# EAGLE design v1 (EAGLE 9.6.2)
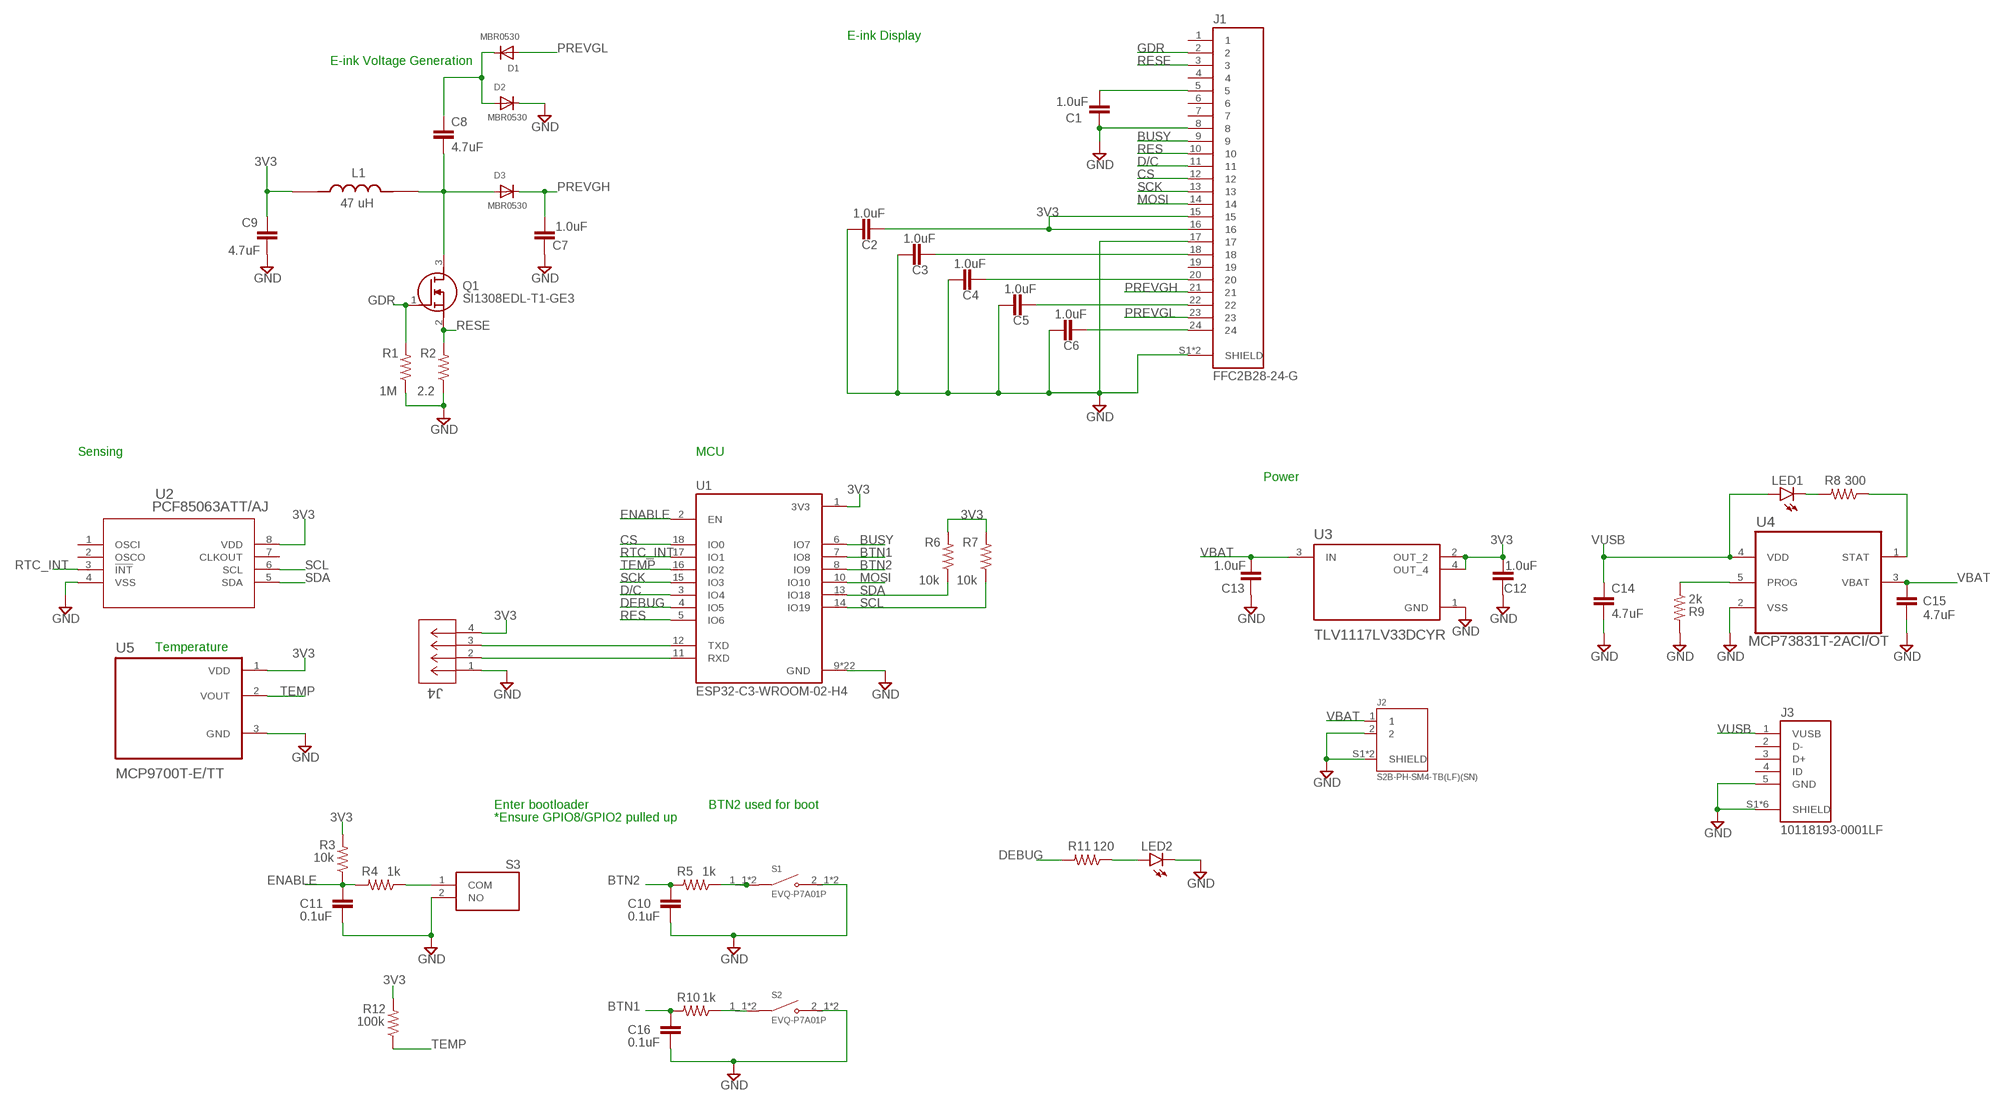
[diagram p0: schematic, sheet 1]

## Parts
C1  1.0uF  1.0UF-0603-16V-10%-X7R-WE  [0603]
C2  1.0uF  1.0UF-0603-16V-10%-X7R-WE  [0603]
C3  1.0uF  1.0UF-0603-16V-10%-X7R-WE  [0603]
C4  1.0uF  1.0UF-0603-16V-10%-X7R-WE  [0603]
C5  1.0uF  1.0UF-0603-16V-10%-X7R-WE  [0603]
C6  1.0uF  1.0UF-0603-16V-10%-X7R-WE  [0603]
C7  1.0uF  1.0UF-0603-16V-10%-X7R-WE  [0603]
C8  4.7uF  4.7UF-0603-35V-(20%)  [0603]
C9  4.7uF  4.7UF-0603-35V-(20%)  [0603]
C10  0.1uF  0.1UF-0603-25V-(+80/-20%)  [0603]
C11  0.1uF  0.1UF-0603-25V-(+80/-20%)  [0603]
C12  1.0uF  1.0UF-0603-16V-10%-X7R-WE  [0603]
C13  1.0uF  1.0UF-0603-16V-10%-X7R-WE  [0603]
C14  4.7uF  4.7UF-0603-35V-(20%)  [0603]
C15  4.7uF  4.7UF-0603-35V-(20%)  [0603]
C16  0.1uF  0.1UF-0603-25V-(+80/-20%)  [0603]
D1  MBR0530  [SOD323F]
D2  MBR0530  [SOD323F]
D3  MBR0530  [SOD323F]
J1  FFC2B28-24-G  [GCT_FFC2B28-24-G]
J2  S2B-PH-SM4-TB(LF)(SN)  [JST_S2B-PH-SM4-TB(LF)(SN)]
J3  10118193-0001LF  [AMPHENOL_10118193-0001LF]
J4  851-43-004-20-001000  [CONN_851-43-004-20-001000_MIM]
L1  47 uH  ADL3225V-470MT-TL000  [IND_ADL3225V-470MT-TL000]
LED1  LEDCHIP-LED0603  [CHIP-LED0603]
LED2  LEDCHIP-LED0603  [CHIP-LED0603]
Q1  SI1308EDL-T1-GE3  [SOT65P210X110-3N]
R1  1M  R-US_R0603  [R0603]
R2  2.2  R-US_R0603  [R0603]
R3  10k  R-US_R0603  [R0603]
R4  1k  R-US_R0603  [R0603]
R5  1k  R-US_R0603  [R0603]
R6  10k  R-US_R0603  [R0603]
R7  10k  R-US_R0603  [R0603]
R8  300  R-US_R0603  [R0603]
R9  2k  R-US_R0603  [R0603]
R10  1k  R-US_R0603  [R0603]
R11  120  R-US_R0603  [R0603]
R12  100k  R-US_R0603  [R0603]
S1  EVQ-P7A01P  [SW_EVQ-P7A01P]
S2  EVQ-P7A01P  [SW_EVQ-P7A01P]
S3  PTS636_SM25F_SMTR_LFS  [PTS636SM25FSMTRLFS]
U1  ESP32-C3-WROOM-02-H4  [MODULE_ESP32-C3-WROOM-02-H4]
U2  PCF85063ATT/AJ  [PCF85063ATT/AJ_NXP]
U3  TLV1117LV33DCYR  [VREG_TLV1117LV33DCYR]
U4  MCP73831T-2ACI/OT  [SOT95P280X145-5N]
U5  MCP9700T-E/TT  [SOT95P237X112-3N]

## Nets
3V3: C2.1 C9.1 C12.1 J1.15 J1.16 J4.4 L1.1 R3.2 R6.2 R7.2 R12.2 U1.1(3V3) U2.8(VDD) U3.2(OUT_2) U3.4(OUT_4) U5.1(VDD)
BTN1: C16.1 R10.2 U1.7(IO8)
BTN2: C10.1 R5.2 U1.8(IO9)
BUSY: J1.9 U1.6(IO7)
CS: J1.12 U1.18(IO0)
D/C: J1.11 U1.3(IO4)
DEBUG: R11.2 U1.4(IO5)
ENABLE: C11.1 R3.1 R4.2 U1.2(EN)
GDR: J1.2 Q1.1(G) R1.2
GND: C1.2 C2.2 C3.2 C4.2 C5.2 C6.2 C7.2 C9.2 C10.2 C11.2 C12.2 C13.2 C14.2 C15.2 C16.2 D2.C J1.8 J1.17 J1.S1(SHIELD) J1.S2(SHIELD) J2.2 J2.S1(SHIELD) J2.S2(SHIELD) J3.5(GND) J3.S1(SHIELD) J3.S2(SHIELD) J3.S3(SHIELD) J3.S4(SHIELD) J3.S5(SHIELD) J3.S6(SHIELD) J4.1 LED2.C R1.1 R2.1 R9.2 S1.2_1 S1.2_2 S2.2_1 S2.2_2 S3.2(NO) U1.9(GND) U1.19(GND) U1.20(GND) U1.21(GND) U1.22(GND) U1.23(GND) U1.24(GND) U1.25(GND) U1.26(GND) U1.27(GND) U1.28(GND) U1.29(GND) U1.30(GND) U1.31(GND) U1.32(GND) U1.33(GND) U1.34(GND) U1.35(GND) U1.36(GND) U1.37(GND) U1.38(GND) U1.39(GND) U2.4(VSS) U3.1(GND) U4.2(VSS) U5.3(GND)
MOSI: J1.14 U1.10(IO10)
N$1: C1.1 J1.5
N$2: C3.1 J1.18
N$3: C4.1 J1.20
N$4: C5.1 J1.22
N$5: C8.2 D3.A L1.2 Q1.3(D)
N$6: C6.1 J1.24
N$7: C8.1 D1.C D2.A
N$8: R4.1 S3.1(COM)
N$9: R5.1 S1.1_1 S1.1_2
N$10: R10.1 S2.1_1 S2.1_2
N$11: J4.3 U1.12(TXD)
N$12: J4.2 U1.11(RXD)
N$13: LED1.C R8.2
N$14: R8.1 U4.1(STAT)
N$15: R9.1 U4.5(PROG)
N$17: LED2.A R11.1
PREVGH: C7.1 D3.C J1.21
PREVGL: D1.A J1.23
RES: J1.10 U1.5(IO6)
RESE: J1.3 Q1.2(S) R2.2
RTC_INT: U1.17(IO1) U2.3(!INT)
SCK: J1.13 U1.15(IO3)
SCL: R7.1 U1.14(IO19) U2.6(SCL)
SDA: R6.1 U1.13(IO18) U2.5(SDA)
TEMP: R12.1 U1.16(IO2) U5.2(VOUT)
VBAT: C13.1 C15.1 J2.1 U3.3(IN) U4.3(VBAT)
VUSB: C14.1 J3.1(VUSB) LED1.A U4.4(VDD)
Unconnected: J1.1 J1.4 J1.6 J1.7 J1.19 J3.2(D-) J3.3(D+) J3.4(ID) U2.1(OSCI) U2.2(OSCO) U2.7(CLKOUT)

## Notes on the sheet
- E-ink Display
- E-ink Voltage Generation
- Sensing | MCU
- Power
- Temperature
- Enter bootloader | BTN2 used for boot
- *Ensure GPIO8/GPIO2 pulled up

## Library data of the parts
C1-C7 C12 C13 = SparkFun-Capacitors:1.0UF: 1µF ceramic capacitors A capacitor is a passive two-terminal electrical component used to store electrical energy temporarily in an electric field.; PROD_ID: CAP-16504
C8 C9 C14 C15 = SparkFun-Capacitors:4.7UF: 4.7µF ceramic capacitors A capacitor is a passive two-terminal electrical component used to store electrical energy temporarily in an electric field.; PROD_ID: CAP-14106
C10 C11 C16 = SparkFun-Capacitors:0.1UF: 0.1µF ceramic capacitors A capacitor is a passive two-terminal electrical component used to store electrical energy temporarily in an electric field.; PROD_ID: CAP-00810
D1-D3 = MBR0530:MBR0530: Check availability <https://pricing.snapeda.com/parts/MBR0530/ON%20Semiconductor/view-part?ref=eda>; AVAILABILITY: In Stock; CHECK_PRICES: https://www.snapeda.com/parts/MBR0530/Onsemi/view-part/?ref=eda; DESCRIPTION: Diode Schottky 30 V 500mA Surface Mount SOD-123; MF: ON Semiconductor; MP: MBR0530; PACKAGE: SOD-123-2 ON Semiconductor; PRICE: None; PURCHASE-URL: https://www.snapeda.com/api/url_track_click_mouser/?unipart_id=179458&manufacturer=ON Semiconductor&part_name=MBR0530&search_term=None; SNAPEDA_LINK: https://www.snapeda.com/parts/MBR0530/Onsemi/view-part/?ref=snap
J1 = FFC2B28-24-G:FFC2B28-24-G: FPC 0.5mm Pitch, Side entry, Dual contact, SMT, Height 1mm, Back Flip Check availability <https://pricing.snapeda.com/parts/FFC2B28-24-G/Global%20Connector%20Technology/view-part?ref=eda>; AVAILABILITY: Not in stock; CHECK_PRICES: https://www.snapeda.com/parts/FFC2B28-24-G/Global+Connector+Technology/view-part/?ref=eda; DESCRIPTION: 24 Position FFC, FPC Connector Contacts, Top and Bottom 0.020 (0.50mm) Surface Mount, Right Angle; MF: Global Connector Technology; MP: FFC2B28-24-G; PACKAGE: None; PRICE: None; SNAPEDA_LINK: https://www.snapeda.com/parts/FFC2B28-24-G/Global+Connector+Technology/view-part/?ref=snap
J2 = S2B-PH-SM4-TB_LF__SN_:S2B-PH-SM4-TB(LF)(SN): PH Series 2 Position 2 mm Pitch Surface Mount Side Entry Shrouded Header Check availability <https://pricing.snapeda.com/parts/S2B-PH-SM4-TB%28LF%29%28SN%29/JST%20Sales/view-part?ref=eda>; AVAILABILITY: In Stock; CHECK_PRICES: https://www.snapeda.com/parts/S2B-PH-SM4-TB(LF)(SN)/JST+Sales+America+Inc./view-part/?ref=eda; DESCRIPTION: Connector Header Surface Mount, Right Angle 2 position 0.079 (2.00mm); MF: JST Sales; MP: S2B-PH-SM4-TB(LF)(SN); PACKAGE: None; PRICE: None; SNAPEDA_LINK: https://www.snapeda.com/parts/S2B-PH-SM4-TB(LF)(SN)/JST+Sales+America+Inc./view-part/?ref=snap
J3 = 10118193-0001LF:10118193-0001LF: Check availability <https://pricing.snapeda.com/parts/10118193-0001LF/Amphenol%20ICC/view-part?ref=eda>; AVAILABILITY: In Stock; CHECK_PRICES: https://www.snapeda.com/parts/10118193-0001LF/Amphenol+FCI/view-part/?ref=eda; DESCRIPTION: Right Angle Surface Mount Mount Female USB Connector 100 V ac 1.8A | Amphenol FCI (Amphenol CS) 10118193-0001LF; MF: Amphenol ICC; MP: 10118193-0001LF; PACKAGE: None; PRICE: None; PURCHASE-URL: https://www.snapeda.com/api/url_track_click_mouser/?unipart_id=110244&manufacturer=Amphenol ICC&part_name=10118193-0001LF&search_term=None; SNAPEDA_LINK: https://www.snapeda.com/parts/10118193-0001LF/Amphenol+FCI/view-part/?ref=snap
J4 = 851-43-004-20-001000:851-43-004-20-001000; COPYRIGHT: Copyright (C) 2024 Ultra Librarian. All rights reserved.; MANUFACTURER_PART_NUMBER: 851-43-004-20-001000; MFR_NAME: Mill-Max
L1 = ADL3225V-470MT-TL000:ADL3225V-470MT-TL000: Check availability <https://pricing.snapeda.com/parts/ADL3225V-470MT-TL000/TDK/view-part?ref=eda>; AVAILABILITY: In Stock; CHECK_PRICES: https://www.snapeda.com/parts/ADL3225V-470MT-TL000/TDK/view-part/?ref=eda; DESCRIPTION: 47 µH Unshielded Wirewound Inductor 500 mA 900mOhm Max 1210 (3225 Metric); MF: TDK; MP: ADL3225V-470MT-TL000; PACKAGE: None; PRICE: None; PURCHASE-URL: https://www.snapeda.com/api/url_track_click_mouser/?unipart_id=1658563&manufacturer=TDK&part_name=ADL3225V-470MT-TL000&search_term=None; SNAPEDA_LINK: https://www.snapeda.com/parts/ADL3225V-470MT-TL000/TDK/view-part/?ref=snap
LED1 LED2 = led:LED: LED OSRAM: - CHIPLED LG R971, LG N971, LY N971, LG Q971, LY Q971, LO R971, LY R971 LH N974, LH R974 LS Q976, LO Q976, LY Q976 LO Q996 - Hyper CHIPLED LW Q18S LB Q993, LB Q99A, LB R99A - SideLED LS A670, LO A670, LY A670, LG A670, LP A670 LB A673, LV A673, LT A673, LW A673 LH A674 LY A675 LS A676, LA A676, LO A676, LY A676, LW A676 LS A679, LY A679, LG A679 - Hyper Micro SIDELED® LS Y876, LA Y876, LO Y876, LY Y876 LT Y87S - SmartLED LW L88C, LW L88S LB L89C, LB L89S, LG L890 LS L89K, LO L89K, LY L89K LS L896, LA L896, LO L896, LY L896 - TOPLED LS T670, LO T670, LY T670, LG T670, LP T670 LSG T670, LSP T670, LSY T670, LOP T670, LYG T670 LG T671, LOG T671, LSG T671 LB T673, LV T673, LT T673, LW T673 LH T674 LS T676, LA T676, LO T676, LY T676, LB T676, LH T676, LSB T676, LW T676 LB T67C, LV T67C, LT T67C, LS T67K, LO T67K, LY T67K, LW E67C LS E67B, LA E67B, LO E67B, LY E67B, LB E67C, LV E67C, LT E67C LW T67C LS T679, LY T679, LG T679 LS T770, LO T770, LY T770, LG T770, LP T770 LB T773, LV T773, LT T773, LW T773 LH T774 LS E675, LA E675, LY E675, LS T675 LS T776, LA T776, LO T776, LY T776, LB T776 LHGB T686 LT T68C, LB T68C - Hyper Mini TOPLED® LB M676 - Mini TOPLED Santana® LG M470 LS M47K, LO M47K, LY M47K Source: http://www.osram.convergy.de LUXEON: - LUMILED® LXK2-PW12-R00, LXK2-PW12-S00, LXK2-PW14-U00, LXK2-PW14-V00 LXK2-PM12-R00, LXK2-PM12-S00, LXK2-PM14-U00 LXK2-PE12-Q00, LXK2-PE12-R00, LXK2-PE12-S00, LXK2-PE14-T00, LXK2-PE14-U00 LXK2-PB12-K00, LXK2-PB12-L00, LXK2-PB12-M00, LXK2-PB14-N00, LXK2-PB14-P00, LXK2-PB14-Q00 LXK2-PR12-L00, LXK2-PR12-M00, LXK2-PR14-Q00, LXK2-PR14-R00 LXK2-PD12-Q00, LXK2-PD12-R00, LXK2-PD12-S00 LXK2-PH12-R00, LXK2-PH12-S00 LXK2-PL12-P00, LXK2-PL12-Q00, LXK2-PL12-R00 Source: www.luxeon.com KINGBRIGHT: KA-3528ASYC Source: www.kingbright.com
Q1 = SI1308EDL-T1-GE3:SI1308EDL-T1-GE3: MOSFET N-Ch 30V 1.5A TrenchFET SC70 Vishay Si1308EDL-T1-GE3 N-channel MOSFET Transistor, 1.5 A, 30 V, 3-Pin SC-70 Source: Datasheet <https://componentsearchengine.com/Datasheets/1/SI1308EDL-T1-GE3.pdf> Check availability <https://pricing.snapeda.com/parts/SI1308EDL-T1-GE3/Vishay%20Siliconix/view-part?ref=eda>; AVAILABILITY: In Stock; CHECK_PRICES: https://www.snapeda.com/parts/SI1308EDL-T1-GE3/Vishay+Siliconix/view-part/?ref=eda; DESCRIPTION: Si1308EDL-T1-GE3 N-channel MOSFET Transistor, 1.5 A, 30 V, 3-Pin SC-70 | Siliconix / Vishay SI1308EDL-T1-GE3; MF: Vishay Siliconix; MP: SI1308EDL-T1-GE3; PACKAGE: SOT-323 Vishay Semiconductor; PRICE: None; PURCHASE-URL: https://www.snapeda.com/api/url_track_click_mouser/?unipart_id=274603&manufacturer=Vishay Siliconix&part_name=SI1308EDL-T1-GE3&search_term=None; SNAPEDA_LINK: https://www.snapeda.com/parts/SI1308EDL-T1-GE3/Vishay+Siliconix/view-part/?ref=snap
R1-R12 = rcl:R-US_: RESISTOR, American symbol; SPICEPREFIX: R
S1 S2 = EVQ-P7A01P:EVQ-P7A01P: Check availability <https://pricing.snapeda.com/parts/EVQ-P7A01P/Panasonic%20Electronic%20Components/view-part?ref=eda>; AVAILABILITY: In Stock; CHECK_PRICES: https://www.snapeda.com/parts/EVQ-P7A01P/Panasonic/view-part/?ref=eda; DESCRIPTION: Switch;Tactile;3.5x2.9mm;Right Angle;Light Touch Switch | Panasonic Electronic Components EVQ-P7A01P; MF: Panasonic Electronic Components; MP: EVQ-P7A01P; PACKAGE: None; PRICE: None; PURCHASE-URL: https://www.snapeda.com/api/url_track_click_mouser/?unipart_id=7409726&manufacturer=Panasonic Electronic Components&part_name=EVQ-P7A01P&search_term=None; SNAPEDA_LINK: https://www.snapeda.com/parts/EVQ-P7A01P/Panasonic/view-part/?ref=snap
S3 = PTS636_SM25F_SMTR_LFS:PTS636_SM25F_SMTR_LFS: Tactile Switches Tact 50mA 12VDC, 6.0x3.5, 2.5mm H, 180gf, F leads, No ground pin, White Actuator Source: Datasheet <https://ms.componentsearchengine.com/Datasheets/1/PTS636 SM25F SMTR LFS.pdf> Check availability <https://pricing.snapeda.com/parts/PTS636%20SM25F%20SMTR%20LFS/C%26K/view-part?ref=eda>; AVAILABILITY: In Stock; CHECK_PRICES: https://www.snapeda.com/parts/PTS636%20SM25F%20SMTR%20LFS/C%2526K/view-part/?ref=eda; DESCRIPTION: Tactile Switch SPST-NO Top Actuated Surface Mount; MF: C&K; MP: PTS636 SM25F SMTR LFS; PACKAGE: None; PRICE: None; SNAPEDA_LINK: https://www.snapeda.com/parts/PTS636%20SM25F%20SMTR%20LFS/C%2526K/view-part/?ref=snap
U1 = ESP32-C3-WROOM-02-H4:ESP32-C3-WROOM-02-H4: WiFi Modules (802.11) (Engineering Samples) SMD module, ESP32-C3, 4MB SPI flash, PCB antenna, -40 C +105 C Check availability <https://pricing.snapeda.com/parts/ESP32-C3-WROOM-02-H4/Espressif%20Systems/view-part?ref=eda> Check availability <https://pricing.snapeda.com/parts/ESP32-C3-WROOM-02-H4/Espressif%20Systems/view-part?ref=eda> Check availability <https://pricing.snapeda.com/parts/ESP32-C3-WROOM-02-H4/Espressif%20Systems/view-part?ref=eda>; AVAILABILITY: In Stock; CHECK_PRICES: https://www.snapeda.com/parts/ESP32-C3-WROOM-02-H4/Espressif+Systems/view-part/?ref=eda; DESCRIPTION: WiFi Modules (802.11) (Engineering Samples) SMD module, ESP32-C3, 4MB SPI flash, PCB antenna, -40 C +105 C; MF: Espressif Systems; MP: ESP32-C3-WROOM-02-H4; PACKAGE: Package; PRICE: None; PURCHASE-URL: https://www.snapeda.com/api/url_track_click_mouser/?unipart_id=5683418&manufacturer=Espressif Systems&part_name=ESP32-C3-WROOM-02-H4&search_term=None; SNAPEDA_LINK: https://www.snapeda.com/parts/ESP32-C3-WROOM-02-H4/Espressif+Systems/view-part/?ref=snap
U2 = PCF85063ATT:AJ:PCF85063ATT/AJ; COPYRIGHT: Copyright (C) 2024 Ultra Librarian. All rights reserved.; MANUFACTURER_PART_NUMBER: PCF85063ATT/AJ; MFR_NAME: NXP
U3 = TLV1117LV33DCYR:TLV1117LV33DCYR: 1-A, low-dropout voltage regulator 4-SOT-223 -40 to 125 Check availability <https://pricing.snapeda.com/parts/TLV1117LV33DCYR/Texas%20Instruments/view-part?ref=eda>; AVAILABILITY: In Stock; CHECK_PRICES: https://www.snapeda.com/parts/TLV1117LV33DCYR/Texas+Instruments/view-part/?ref=eda; DESCRIPTION: 1-A, low-dropout voltage regulator; MF: Texas Instruments; MP: TLV1117LV33DCYR; PACKAGE: SOT-223-4 Texas Instruments; PRICE: None; PURCHASE-URL: https://www.snapeda.com/api/url_track_click_mouser/?unipart_id=229607&manufacturer=Texas Instruments&part_name=TLV1117LV33DCYR&search_term=None; SNAPEDA_LINK: https://www.snapeda.com/parts/TLV1117LV33DCYR/Texas+Instruments/view-part/?ref=snap
U4 = MCP73831T-2ACI_OT:MCP73831T-2ACI/OT: Charge Management Controller Check availability <https://pricing.snapeda.com/parts/MCP73831T-2ACI/OT/Microchip/view-part?ref=eda>; AVAILABILITY: In Stock; CHECK_PRICES: https://www.snapeda.com/parts/MCP73831T-2ACI/OT/Microchip/view-part/?ref=eda; DESCRIPTION: TINY INTEGRATED LI-ION/LI-POLY CHARGE MGNT CONTROLLER, 4.2V VREG | Microchip Technology Inc. MCP73831T-2ACI/OT; MF: Microchip; MP: MCP73831T-2ACI/OT; PACKAGE: SOT-23 Microchip; PRICE: None; PURCHASE-URL: https://www.snapeda.com/api/url_track_click_mouser/?unipart_id=53208&manufacturer=Microchip&part_name=MCP73831T-2ACI/OT&search_term=None; SNAPEDA_LINK: https://www.snapeda.com/parts/MCP73831T-2ACI/OT/Microchip/view-part/?ref=snap
U5 = MCP9700T-E_TT:MCP9700T-E/TT: Check availability <https://pricing.snapeda.com/parts/MCP9700T-E/TT/Microchip/view-part?ref=eda>; AVAILABILITY: In Stock; CHECK_PRICES: https://www.snapeda.com/parts/MCP9700T-E/TT/Microchip/view-part/?ref=eda; DESCRIPTION: Microchip MCP9700T-E/TT Temperature Sensor 3-Pin SOT-23, -40 - +125 degC | Microchip Technology Inc. MCP9700T-E/TT; MF: Microchip; MP: MCP9700T-E/TT; PACKAGE: SOT-23-3 Microchip; PRICE: None; PURCHASE-URL: https://www.snapeda.com/api/url_track_click_mouser/?unipart_id=134539&manufacturer=Microchip&part_name=MCP9700T-E/TT&search_term=None; SNAPEDA_LINK: https://www.snapeda.com/parts/MCP9700T-E/TT/Microchip/view-part/?ref=snap

## Board
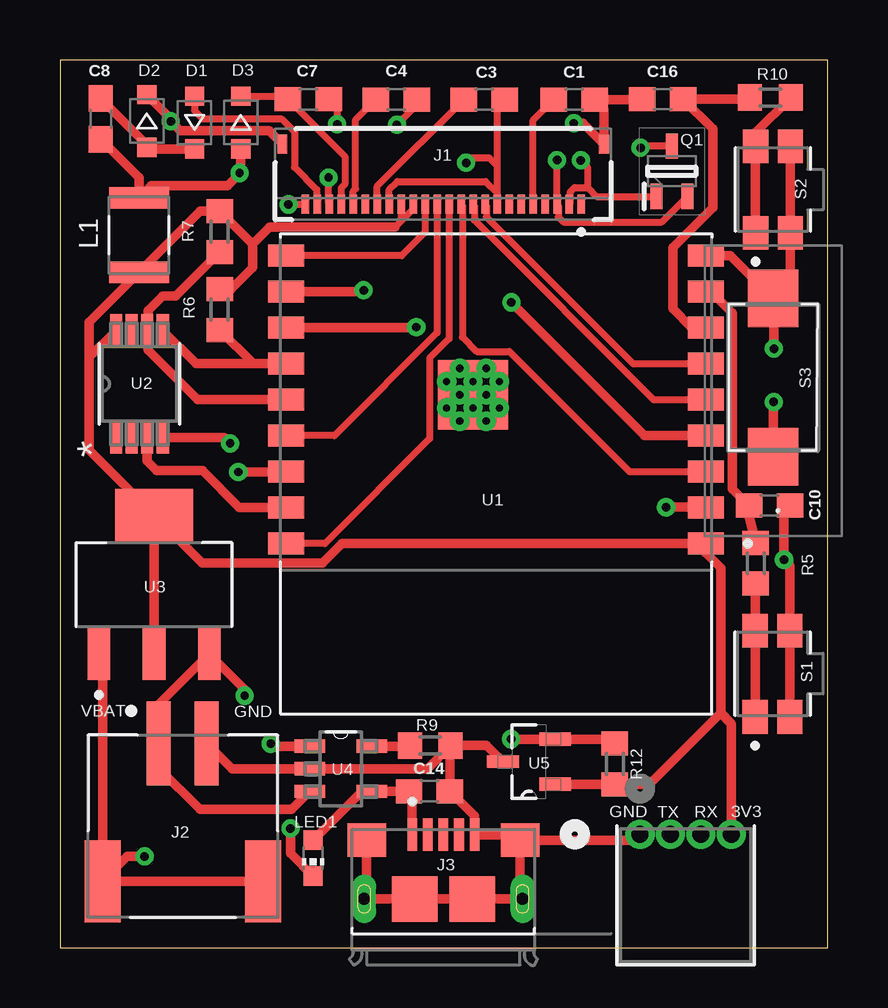
[diagram p1: board, top side]
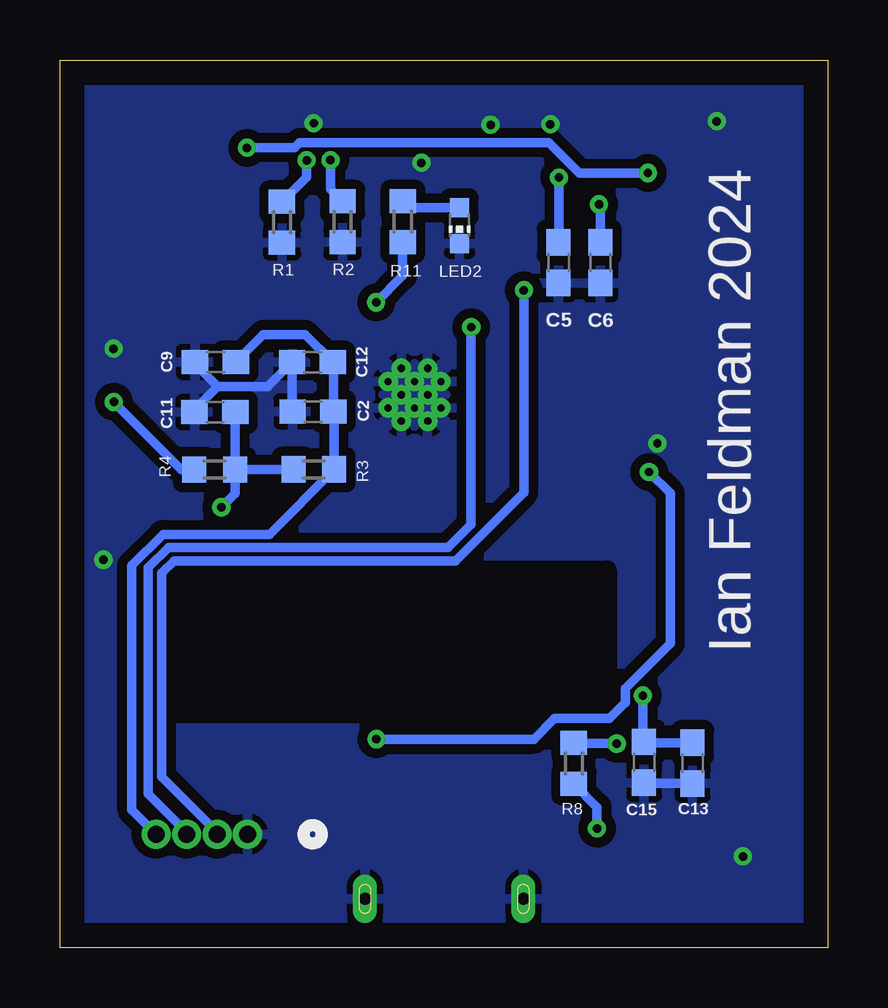
[diagram p2: board, bottom side, seen from below]

Size 32 x 37 mm. Coordinates in mm from the lower left corner, seen from the top.
Outline: 0,0 32,0 32,37 0,37 0,0
Copper layers (1*16): Top 0.035mm / dielectric 1.5mm / Bottom 0.035mm
Design rules "default": minimum track width 6mil, minimum drill 0.35mm, track to track 6mil, track to pad 6mil, pad to pad 6mil, via to via 6mil, smd to smd 6mil, copper to edge 40mil, drill to drill 6mil, minimum pad ring 10mil, minimum via ring 8mil, stop-mask expansion 4mil, vias tented up to drill 0mil, thermal gap 10mil

### Footprints (pad centres in the part's own frame; a part is rotated, then mirrored left to right if it is on the bottom)
0603 = smd 1.1 x 1: 1 -0.85,0; 2 0.85,0
SOD323F = smd 0.8 x 0.8: A 1.1,0; C -1.1,0
GCT_FFC2B28-24-G = smd 0.3 x 0.8: 1 -5.75,1.25; 2 -5.25,1.25; 3 -4.75,1.25; 4 -4.25,1.25; 5 -3.75,1.25; 6 -3.25,1.25; 7 -2.75,1.25; 8 -2.25,1.25; 9 -1.75,1.25; 10 -1.25,1.25; 11 -0.75,1.25; 12 -0.25,1.25; 13 0.25,1.25; 14 0.75,1.25; 15 1.25,1.25; 16 1.75,1.25; 17 2.25,1.25; 18 2.75,1.25; 19 3.25,1.25; 20 3.75,1.25; 21 4.25,1.25; 22 4.75,1.25; 23 5.25,1.25; 24 5.75,1.25 | smd 0.4 x 0.8: S1 -6.7,-1.25; S2 6.7,-1.25
JST_S2B-PH-SM4-TB(LF)(SN) = smd 1 x 3.5: 1 -1,0; 2 1,0 | smd 1.5 x 3.4: S1 -3.35,-5.75; S2 3.35,-5.75
AMPHENOL_10118193-0001LF = smd 0.4 x 1.35: 1 -1.3,2.675; 2 -0.65,2.675; 3 0,2.675; 4 0.65,2.675; 5 1.3,2.675 | smd 1.6 x 1.4: S1 -3.2,2.45; S2 3.2,2.45 | smd 1.9 x 1.9: S3 1.2,0; S4 -1.2,0 | drill 0.5 pad 0.9 long: S5 -3.3,0; S6 3.3,0
CONN_851-43-004-20-001000_MIM = drill 0.711 pad 1.168: 1 0,0; 2 1.27,0; 3 2.54,0; 4 3.81,0
IND_ADL3225V-470MT-TL000 = smd 0.9 x 2.5: 1 -1.55,0; 2 1.55,0
CHIP-LED0603 = smd 0.8 x 0.8: A 0,-0.75; C 0,0.75
SOT65P210X110-3N = smd 1.05 x 0.5: 1 -1.05,0.65; 2 -1.05,-0.65; 3 1.05,0
R0603 = smd 1 x 1.1: 1 -0.85,0; 2 0.85,0
SW_EVQ-P7A01P = smd 1.4 x 1.05: 1_1 -1.8,0.725; 1_2 1.8,0.725; 2_1 -1.8,-0.725; 2_2 1.8,-0.725
PTS636SM25FSMTRLFS = smd 2.4 x 2.1: 1 -3.3,0; 2 3.3,0
MODULE_ESP32-C3-WROOM-02-H4 = smd 1.5 x 0.9: 1 -8.75,2.9; 2 -8.75,1.4; 3 -8.75,-0.1; 4 -8.75,-1.6; 5 -8.75,-3.1; 6 -8.75,-4.6; 7 -8.75,-6.1; 8 -8.75,-7.6; 9 -8.75,-9.1; 10 8.75,-9.1; 11 8.75,-7.6; 12 8.75,-6.1; 13 8.75,-4.6; 14 8.75,-3.1; 15 8.75,-1.6; 16 8.75,-0.1; 17 8.75,1.4; 18 8.75,2.9 | smd 0.7 x 0.7: 19 -0.14,-2.2; 20 0.96,-2.2; 21 2.06,-2.2; 22 -0.14,-3.3; 23 0.96,-3.3; 24 2.06,-3.3; 25 -0.14,-4.4; 26 0.96,-4.4; 27 2.06,-4.4 | drill 0.3 pad 0.4: 28 0.41,-2.2; 29 1.51,-2.2; 30 -0.14,-2.75; 31 0.96,-2.75; 32 2.06,-2.75; 33 0.41,-3.3; 34 1.51,-3.3; 35 -0.14,-3.85; 36 0.96,-3.85; 37 2.06,-3.85; 38 0.41,-4.4; 39 1.51,-4.4
PCF85063ATT/AJ_NXP = smd 1.359 x 0.508: 1 -2.229,0.975; 2 -2.229,0.325; 3 -2.229,-0.325; 4 -2.229,-0.975; 5 2.229,-0.975; 6 2.229,-0.325; 7 2.229,0.325; 8 2.229,0.975
VREG_TLV1117LV33DCYR = smd 2.15 x 0.95: 1 -2.9,2.3; 2 -2.9,0; 3 -2.9,-2.3 | smd 2.15 x 3.25: 4 2.9,0
SOT95P280X145-5N = smd 1.27 x 0.559: 1 -1.295,0.94; 2 -1.295,0; 3 -1.295,-0.94; 4 1.295,-0.94; 5 1.295,0.94
SOT95P237X112-3N = smd 1.321 x 0.559: 1 -1.092,0.94; 2 -1.092,-0.94 | smd 1.321 x 0.508: 3 1.092,0

### Placement (x,y rotation side)
C1  21.44,35.34 0 top
C2  21.45,22.35 180 bottom
C3  17.69,35.35 0 top
C4  14.02,35.35 0 top
C5  11.22,28.55 270 bottom
C6  9.48,28.55 270 bottom
C7  10.35,35.36 0 top
C8  1.7,34.54 270 top
C9  25.52,24.41 180 bottom
C10  29.58,18.42 0 top
C11  25.54,22.32 180 bottom
C12  21.47,24.4 180 bottom
C13  5.63,7.69 270 bottom
C14  15.4,6.52 0 top
C15  7.66,7.72 270 bottom
C16  25.12,35.37 180 top
D1  5.61,34.39 90 top
D2  3.62,34.46 270 top
D3  7.54,34.39 270 top
J1  15.98,32.23 180 top
J2  5.12,8.51 0 top
J3  15.98,2.03 0 top
J4  24.18,4.72 0 top
L1  3.3,29.7 90 top
LED1  10.55,3.73 180 top
LED2  15.34,30.1 180 bottom
Q1  25.51,32.36 90 top
R1  22.74,30.24 90 bottom
R2  20.22,30.25 90 bottom
R3  21.42,19.93 0 bottom
R4  25.55,19.93 0 bottom
R5  29,16.02 90 top
R6  6.66,26.6 90 top
R7  6.66,29.85 90 top
R8  10.58,7.68 270 bottom
R9  15.43,8.42 0 top
R10  29.61,35.43 180 top
R11  17.71,30.26 270 bottom
R12  23.13,7.66 270 top
S1  29.71,11.41 90 top
S2  29.72,31.59 90 top
S3  29.73,23.77 90 top
U1  18.18,19.74 180 top
U2  3.31,23.5 90 top
U3  3.93,15.13 90 top
U4  11.71,7.45 0 top
U5  19.56,7.75 180 top

### Tracks (layer width: path | path; a pad name or v marks a point on that pad's centre or on a via)
3V3
  Top 0.3: J1.16 14.22,30.29 | 14.22,30.29 13.96,30.03 | 14.22,30.29 14.72,30.79 J1.15
  Top 0.4: U3.2 U3.4 | R6.2 7.14,27.45 8.04,28.34 8.04,29.32 | 8.04,29.32 R7.2 5.85,30.7 L1.1 1.22,26.07 1.22,24.61 | U3.4 5.92,16.04 10.95,16.04 11.75,16.84 U1.1 26.93,16.44 27.54,15.83 27.54,9.78 | U3.4 1.22,20.74 1.22,24.61 | 1.22,24.61 U2.8 | 8.04,29.32 8.74,30.03 13.96,30.03 | J4.4 27.99,9.33 27.54,9.78 | U5.1 R12.2 24.57,6.81 27.54,9.78
  Bottom 0.4: C9.1 23.53,25.56 21.78,25.56 C12.1 20.6,24.38 C2.1 20.57,22.31 R3.2 23.27,17.23 27.7,17.23 29.01,15.92 29,15.91 29,5.73 J4.4
BTN1
  Top 0.4: U1.7 26.33,25.84 25.55,26.63 25.55,29.18 27.21,30.85 27.21,34.13 C16.1 28.7,35.37 R10.2
BTN2
  Top 0.4: U1.8 27.13,27.34 28.03,26.44 28.03,19.12 C10.1 28.64,18.34 R5.2
BUSY
  Top 0.3: J1.9 17.77,30.94 17.77,30.46 23.89,24.34 U1.6
CS
  Top 0.3: J1.12 16.23,25.38 15.41,24.56 15.41,21.21 11.04,16.84 U1.18
D/C
  Top 0.3: J1.11 16.77,30.94 16.77,25.44 17.37,24.85 18.74,24.85 23.75,19.84 U1.3
DEBUG  (via drill 0.35)
  Top 0.4: U1.4 24.37,21.34 v18.82,26.89
  Bottom 0.4: v18.82,26.89 17.71,28 R11.2
ENABLE  (via drill 0.35)
  Top 0.4: v25.27,18.36 26.91,18.36 U1.2
  Bottom 0.4: v25.27,18.36 24.7,18.92 R4.2 | C11.1 24.7,22.31 R4.2 | R3.1 R4.2
GDR  (via drill 0.35)
  Top 0.3: J1.2 21.27,31.03 21.27,31.51 21.45,31.69 22,31.69 | Q1.1 22.37,31.31 22,31.69 | 22,31.69 22,32.53 v21.71,32.82
  Bottom 0.4: v21.71,32.82 21.71,32.12 R1.2
GND  (via drill 0.35)
  Top 0.3: 18.23,32.59 18.23,35.04 C3.2 | J1.17 13.72,31.6 14.06,31.94 17.75,31.94 18.23,31.46 J1.8 | C7.2 11.56,35 v11.56,34.32 | C4.2 14.87,35.12 v14.05,34.3 | 18.23,32.59 17.9,32.91 17.13,32.91 v16.93,32.72 | J1.8 | 18.23,32.59 J1.8 | J1.8
  Top 0.4: S2.2_2 S2.2_1 30.45,27.78 S3.2 | 18.96,4.7 J3.5 17.28,5.49 C14.2 16.25,8.39 R9.2 | J3.S1 12.78,2.13 J3.S5 J3.S4 J3.S3 J3.S6 19.18,2.13 J3.S2 23.94,4.48 J4.1 | J2.2 7.18,7.45 U4.2 15.31,7.45 R9.2 | J2.S1 1.77,12.08 U3.1 | S3.2 27.96,28.84 U1.9 | C16.2 24.25,35.34 C1.2 22.68,34.96 J1.S1 21.79,34.37 v21.42,34.37 | J2.S1 2.81,3.8 v3.53,3.8 | D2.C 4.62,34.56 v4.62,34.44 5.02,34.04 6.99,34.04 6.99,34.05 8.71,34.05 J1.S2 | S3.2 29.76,27.04 v29.76,24.96 | S1.2_1 S1.2_2 30.43,15.92 v30.19,16.17 30.19,18.18 C10.2 | U1.26 U1.39 U1.27 U1.37 U1.24 | U1.26 U1.38 U1.25 U1.35 U1.22 | U1.23 U1.33 U1.22 | U1.23 U1.34 U1.24 | U1.26 U1.36 U1.23 | U1.23 U1.31 U1.20 | U1.24 U1.32 U1.21 U1.29 U1.20 | U1.20 U1.28 U1.19 U1.30 U1.22 | U5.3 17.79,8.42 R9.2 | U2.4 6.84,21.27 v7.09,21.01 | J2.S1 J2.S2
  Top 0.5: 18.96,4.7 J3.S2
  Bottom 0.4: C13.2 7.62,6.84 C15.2 | C2.2 22.32,22.37 C12.2 23.34,23.38 25.43,23.38 | 25.43,23.38 26.37,24.31 C9.2 | 25.43,23.38 26.39,22.43 C11.2
  pour Bottom (isolate 0.4): 0,37 32,37 32,0 0,0
MOSI
  Top 0.3: J1.14 15.22,29.82 14.24,28.84 U1.10
N$1
  Top 0.3: J1.5 19.73,34.48 C1.1
N$2
  Top 0.3: J1.18 13.22,31.74 C3.1
N$3
  Top 0.3: J1.20 12.22,31.52 12.33,31.63 12.33,34.51 C4.1
N$4  (via drill 0.35)
  Top 0.3: J1.22 11.2,31.01 v11.2,32.1
  Bottom 0.4: v11.2,32.1 11.2,29.42 C5.1
N$5  (via drill 0.35)
  Top 0.3: Q1.3 24.27,33.41 v24.2,33.34
  Top 0.4: C8.2 3.3,32.09 L1.2 3.81,31.76 6.98,31.76 7.49,32.27 v7.49,32.29 7.54,32.34 D3.A
  Bottom 0.4: v24.2,33.34 22.23,33.34 22.01,33.56 11.62,33.56 10.34,32.27 7.51,32.27 v7.49,32.29
N$6  (via drill 0.35)
  Top 0.3: J1.24 v9.53,30.98
  Bottom 0.3: 9.48,30.93 v9.53,30.98
  Bottom 0.4: C6.1 9.48,30.93
N$7
  Top 0.4: C8.1 3.62,33.47 D2.A 3.69,33.29 D1.C
N$8  (via drill 0.35)
  Top 0.4: S3.1 29.73,22.72 v29.75,22.74
  Bottom 0.4: R4.1 26.94,19.93 v29.75,22.74
N$9
  Top 0.4: R5.1 28.98,14.79 S1.1_2 S1.1_1
N$10
  Top 0.4: S2.1_1 S2.1_2 29,33.97 R10.1
N$11  (via drill 0.35)
  Top 0.4: U1.12 14.83,25.84 v14.86,25.86
  Bottom 0.4: v14.86,25.86 14.86,17.64 15.82,16.68 27.48,16.68 28.31,15.84 28.31,6.4 27.03,5.12 27.03,5.03 J4.3
N$12  (via drill 0.35)
  Top 0.4: U1.11 12.6,27.34 v12.66,27.4
  Bottom 0.4: v12.66,27.4 12.66,18.98 15.52,16.12 27.25,16.12 27.76,15.61 27.76,7.12 25.76,5.12 25.76,5.03 J4.2
N$13  (via drill 0.35)
  Top 0.4: LED1.C 9.61,3.92 v9.61,4.96
  Bottom 0.4: v9.61,4.96 9.61,5.85 R8.2
N$14  (via drill 0.35)
  Top 0.4: U4.1 8.9,8.39 v8.79,8.5
  Bottom 0.4: R8.1 10.55,8.5 v8.79,8.5
N$15
  Top 0.4: U4.5 14.55,8.39 R9.1
N$17
  Bottom 0.4: R11.1 17.45,30.85 LED2.A
PREVGH
  Top 0.3: D3.C 9.37,35.49 C7.1 11.88,32.98 11.88,31.82 11.72,31.66 J1.21
PREVGL
  Top 0.3: J1.23 10.7,31.01 10.7,31.6 9.78,32.52 9.78,34.01 9.24,34.55 5.95,34.55 5.61,34.89 D1.A
RES
  Top 0.3: J1.10 17.27,30.94 17.27,30.32 24.75,22.84 U1.5
RESE  (via drill 0.35)
  Top 0.3: Q1.2 25.09,30.24 20.99,30.24 20.77,30.46 20.77,30.94 J1.3 v20.73,32.83 v20.72,32.83
  Bottom 0.4: v20.72,32.83 20.72,31.61 R2.2
RTC_INT
  Top 0.4: U2.3 3.64,20.27 4.04,19.88 5.94,19.88 7.48,18.34 U1.17
SCK
  Top 0.3: J1.13 15.72,25.62 11.44,21.34 U1.15
SCL
  Top 0.4: U2.6 3.68,25.68 | 3.68,25.68 3.68,24.9 5.74,22.84 U1.14 | R7.1 4.81,27.15 4.28,27.15 3.68,26.55 3.68,25.68
SDA
  Top 0.4: R6.1 8.07,24.34 U1.13 5.67,24.34 U2.5
TEMP  (via drill 0.35)
  Top 0.4: v18.81,8.69 U5.2 22.95,8.69 R12.1 | v7.44,19.82 9.4,19.82 U1.16
  Bottom 0.4: v18.81,8.69 12.24,8.69 11.38,9.54 9.1,9.54 8.46,10.18 | 8.46,10.18 | 8.46,10.18 8.43,10.21 8.43,10.8 6.56,12.68 6.56,18.94 v7.44,19.82
VBAT  (via drill 0.35)
  Top 0.4: U4.3 9.65,5.75 5.85,5.75 4.12,7.48 4.12,7.52 | v7.7,10.5 7.7,10.76 U3.3 4.12,10.13 J2.1
  Top 0.5: J2.1 4.12,7.52
  Bottom 0.4: C13.1 7.62,8.54 C15.1 7.7,8.62 v7.7,10.5
VUSB
  Top 0.4: C14.1 U4.4 12.59,6.51 LED1.A | C14.1 | J3.1 14.68,6.37 C14.1

### Text on the board
tNames: U2 | S1 | VBAT | GND | GND | TX | RX | 3V3
bNames: Ian Feldman 2024